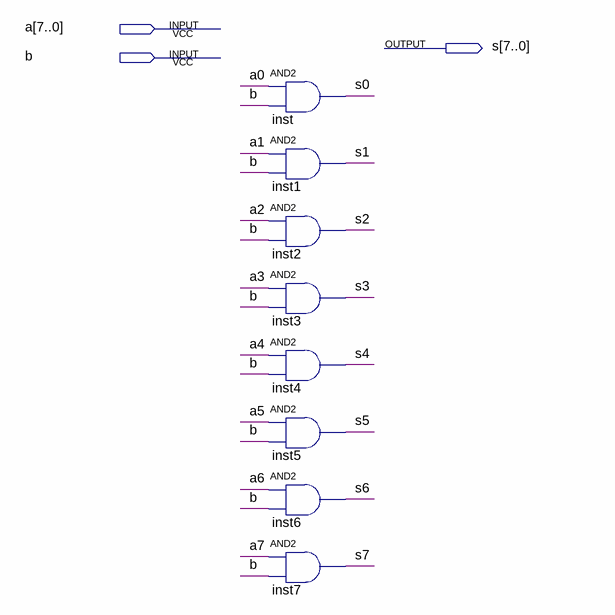
[diagram p0: schematic sheet]
// Quartus schematic and8_1.bdf as structural Verilog: 8 symbols, 3 pins
module and8_1 (
  input  [7:0] a,
  input  b,
  output [7:0] s
);

  and inst (s[0], a[0], b);
  and inst1 (s[1], a[1], b);
  and inst2 (s[2], a[2], b);
  and inst3 (s[3], a[3], b);
  and inst4 (s[4], a[4], b);
  and inst5 (s[5], a[5], b);
  and inst6 (s[6], a[6], b);
  and inst7 (s[7], a[7], b);
endmodule
